# EAGLE design MRCS-RelayBreakout (EAGLE 7.7.0)
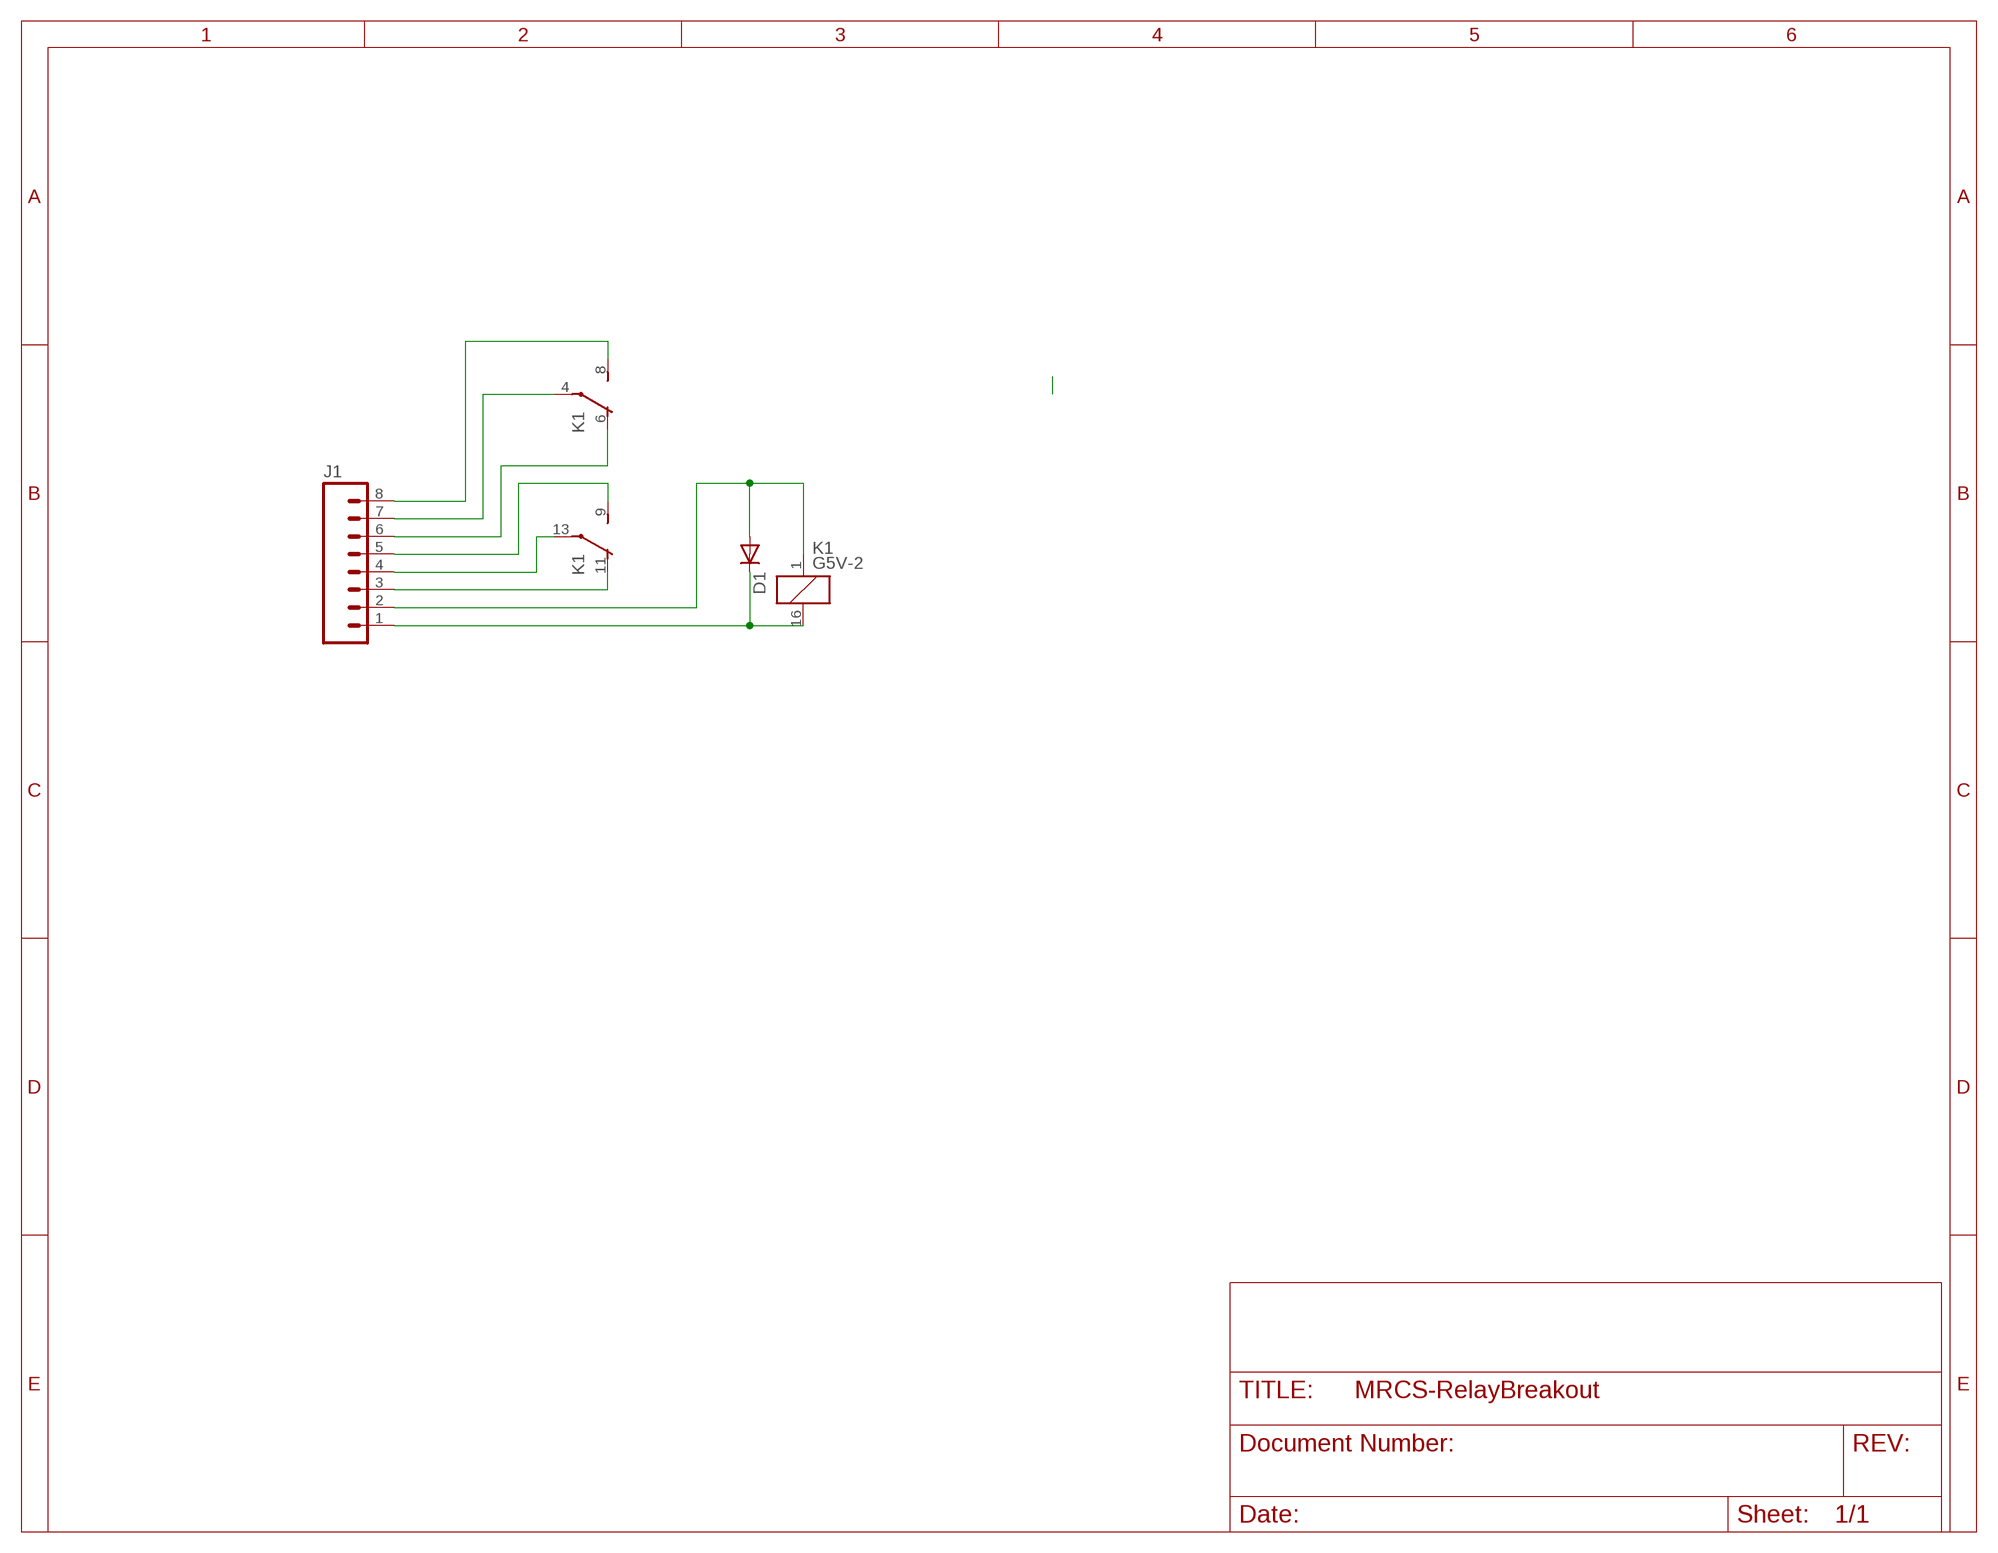
[diagram p0: schematic, sheet 1]

## Parts
D1  DIODEPTH  [DIODE-1N4001]
J1  CONNECTOR-M08LOCK  [1X08_LOCK]
K1  G5V-2  [G5V-2]

## Nets
N$1: D1.C J1.1 K1.16
N$2: D1.A J1.2 K1.1
N$3: J1.3 K1.11(2:O)
N$4: J1.4 K1.13(2:P)
N$6: J1.5 K1.9(2:S)
N$7: J1.6 K1.6(1:O)
N$8: J1.7 K1.4(1:P)
N$9: J1.8 K1.8(1:S)

## Library data of the parts
D1 = SPCoast:DIODE: Diode These are standard reverse protection diodes and small signal diodes. SMA package can handle up to about 1A. SOD-323 can handle about 200mA. What the SOD-323 package when ordering, there are some mfgs out there that are 5-pin packages.
J1 = SPCoast:CONNECTOR-M08: Header 8 Standard 8-pin 0.1" header. Use with straight break away headers (SKU : PRT-00116), right angle break away headers (PRT-00553), swiss pins (PRT-00743), machine pins (PRT-00117), and female headers (PRT-00115).
K1 = relay:G5V-2: OMRON PCB Relay Source: http://www.omron.com/ecb/products/pdf/en-g5v2.pdf; MPN: G5V-2 5DC; OC_FARNELL: 9949488; OC_NEWARK: 78K5703

## Board
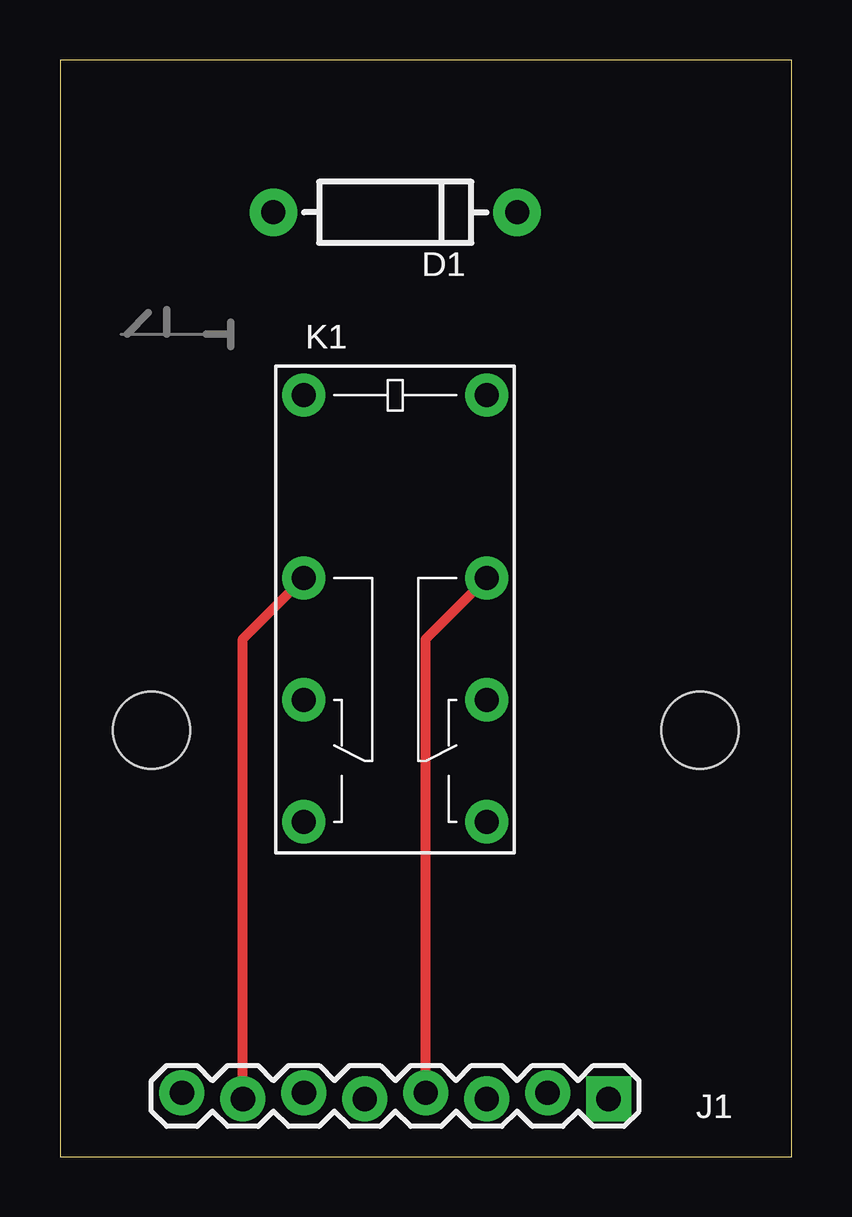
[diagram p1: board, top side]
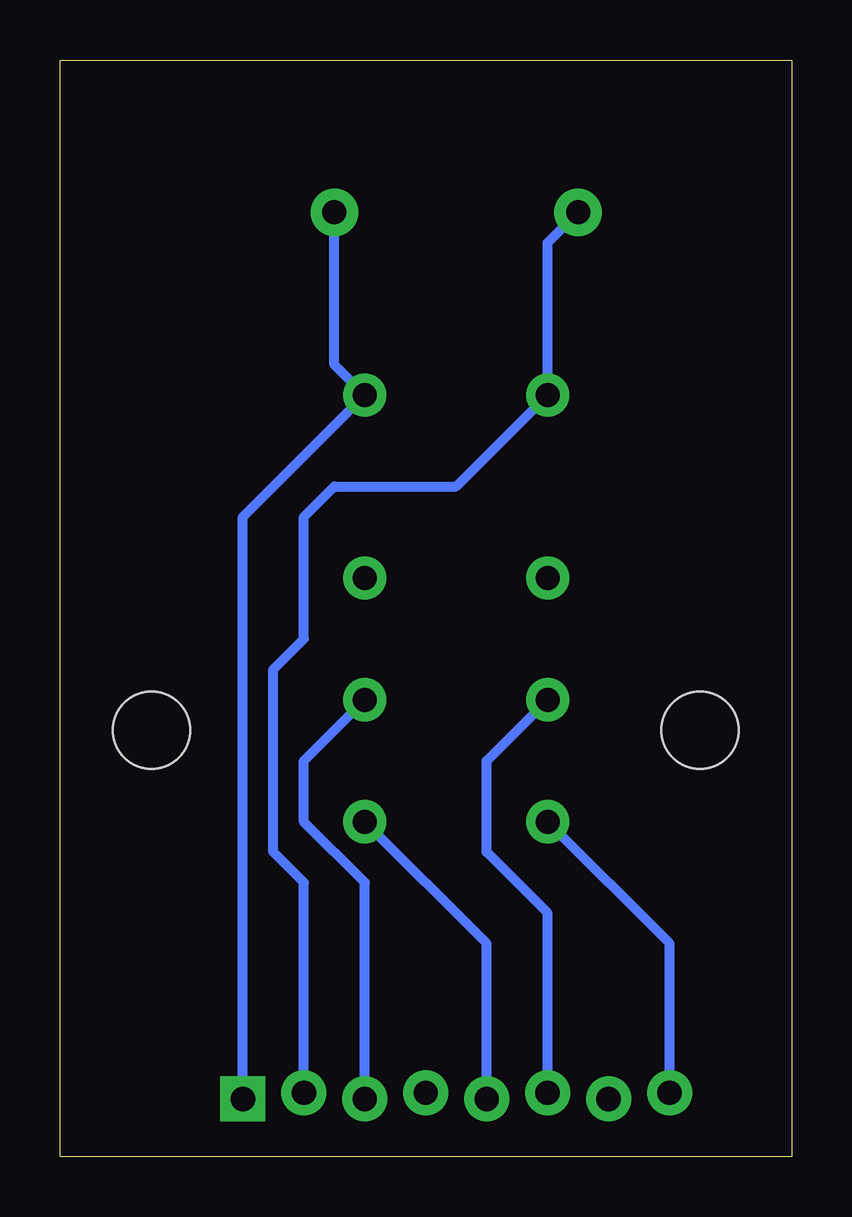
[diagram p2: board, bottom side, seen from below]

Size 30.48 x 45.72 mm. Coordinates in mm from the lower left corner, seen from the top.
Outline: 0,0 30.48,0 30.48,45.72 0,45.72 0,0
Copper layers (1*16): Top 0.035mm / dielectric 1.5mm / Bottom 0.035mm
Design rules "default": minimum track width 10mil, minimum drill 24mil, track to track 8mil, track to pad 8mil, pad to pad 8mil, via to via 8mil, smd to smd 8mil, copper to edge 40mil, drill to drill 8mil, minimum pad ring 10mil, minimum via ring 8mil, stop-mask expansion 4mil, vias tented up to drill 0mil, thermal gap 10mil
Holes 3.2 mm at 3.81,17.78 26.67,17.78

### Footprints (pad centres in the part's own frame; a part is rotated, then mirrored left to right if it is on the bottom)
DIODE-1N4001 = drill 1 pad 1.981: A 5.08,0; C -5.08,0
1X08_LOCK = drill 1.016 pad 1.88 square: 1 0,0.127 | drill 1.016 pad 1.88: 2 2.54,-0.127; 3 5.08,0.127; 4 7.62,-0.127; 5 10.16,0.127; 6 12.7,-0.127; 7 15.24,0.127; 8 17.78,-0.127
G5V-2 = drill 1 pad 1.8: 1 -8.89,-3.81; 4 -1.27,-3.81; 6 3.81,-3.81; 8 8.89,-3.81; 9 8.89,3.81; 11 3.81,3.81; 13 -1.27,3.81; 16 -8.89,3.81

### Placement (x,y rotation side)
D1  13.97,39.37 180 top
J1  22.86,2.54 180 top
K1  13.97,22.86 270 top
U$1  [MRCSLOGOTOP]  7.62,33.02 90 top

### Tracks (layer width: path | path; a pad name or v marks a point on that pad's centre or on a via)
N$1
  Bottom 0.406: J1.1 22.86,26.67 K1.16 19.05,33.02 D1.C
N$2
  Bottom 0.406: D1.A 10.16,38.1 K1.1 13.97,27.94 19.05,27.94 20.32,26.67 20.32,21.59 21.59,20.32 21.59,12.7 20.32,11.43 J1.2
N$3
  Bottom 0.406: J1.3 17.78,11.43 20.32,13.97 20.32,16.51 K1.11
N$4
  Top 0.406: J1.4 15.24,21.59 K1.13
N$6
  Bottom 0.406: J1.5 12.7,8.89 K1.9
N$7
  Bottom 0.406: J1.6 10.16,10.16 12.7,12.7 12.7,16.51 K1.6
N$8
  Top 0.406: J1.7 7.62,21.59 K1.4
N$9
  Bottom 0.406: J1.8 5.08,8.89 K1.8

### Text on the board
tDocu: DPDT Relay / Breakout | NO 2 / COM 2 / NC 2 / NO 1 / COM 1 / NC 1 / V - / V+
_tNames: D1 | K1 | J1